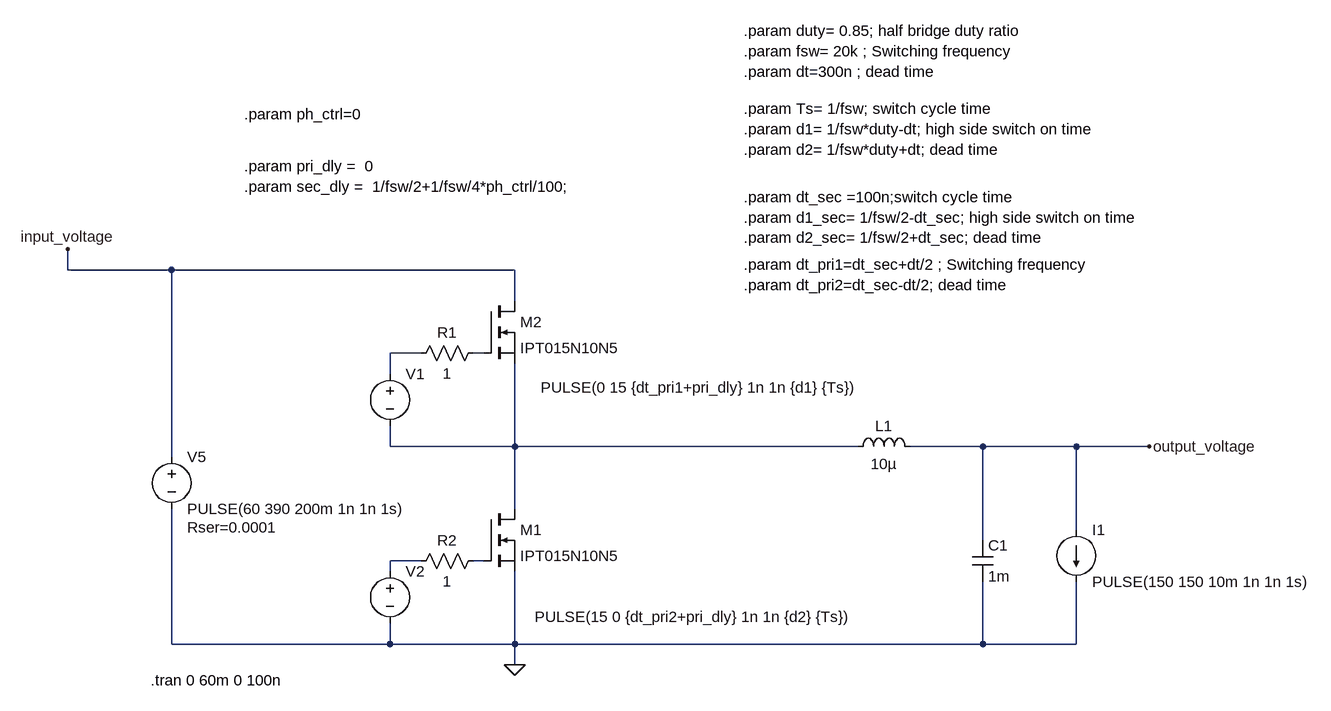
[diagram p0: schematic synch_buck_highcurrent.asc]
synch_buck_highcurrent.asc, the LTspice schematic file:
Version 4
SHEET 1 3064 1092
WIRE -880 -208 -880 -240
WIRE -720 -208 -880 -208
WIRE -192 -208 -720 -208
WIRE -192 -160 -192 -208
WIRE -336 -80 -384 -80
WIRE -240 -80 -256 -80
WIRE -384 -48 -384 -80
WIRE -384 64 -384 32
WIRE -192 64 -192 -64
WIRE -192 64 -384 64
WIRE 336 64 -192 64
WIRE 528 64 416 64
WIRE 672 64 528 64
WIRE 784 64 672 64
WIRE -720 80 -720 -208
WIRE -192 160 -192 64
WIRE 672 192 672 64
WIRE 528 208 528 64
WIRE -336 240 -384 240
WIRE -240 240 -256 240
WIRE -384 256 -384 240
WIRE -720 368 -720 160
WIRE -384 368 -384 336
WIRE -384 368 -720 368
WIRE -192 368 -192 256
WIRE -192 368 -384 368
WIRE 528 368 528 272
WIRE 528 368 -192 368
WIRE 672 368 672 272
WIRE 672 368 528 368
WIRE -192 400 -192 368
FLAG -192 400 0
FLAG -880 -240 input_voltage
FLAG 784 64 output_voltage
SYMBOL nmos -240 160 R0
SYMATTR InstName M1
SYMATTR Value IPT015N10N5
SYMBOL nmos -240 -160 R0
SYMATTR InstName M2
SYMATTR Value IPT015N10N5
SYMBOL voltage -384 -64 R0
WINDOW 123 0 0 Left 2
WINDOW 39 0 0 Left 2
WINDOW 3 232 37 Left 2
SYMATTR Value PULSE(0 15 {dt_pri1+pri_dly} 1n 1n {d1} {Ts})
SYMATTR InstName V1
SYMBOL voltage -384 240 R0
WINDOW 123 0 0 Left 2
WINDOW 39 0 0 Left 2
WINDOW 3 223 86 Left 2
SYMATTR Value PULSE(15 0 {dt_pri2+pri_dly} 1n 1n {d2} {Ts})
SYMATTR InstName V2
SYMBOL res -240 -96 R90
WINDOW 0 0 56 VBottom 2
WINDOW 3 32 56 VTop 2
SYMATTR InstName R1
SYMATTR Value 1
SYMBOL res -240 224 R90
WINDOW 0 0 56 VBottom 2
WINDOW 3 32 56 VTop 2
SYMATTR InstName R2
SYMATTR Value 1
SYMBOL voltage -720 64 R0
WINDOW 123 0 0 Left 2
WINDOW 39 24 124 Left 2
SYMATTR SpiceLine Rser=0.0001
SYMATTR InstName V5
SYMATTR Value PULSE(60 390 200m 1n 1n 1s)
SYMBOL ind 320 80 R270
WINDOW 0 32 56 VTop 2
WINDOW 3 5 56 VBottom 2
SYMATTR InstName L1
SYMATTR Value 10µ
SYMATTR SpiceLine Rser=1m
SYMBOL cap 512 208 R0
SYMATTR InstName C1
SYMATTR Value 1m
SYMBOL current 672 192 R0
WINDOW 123 0 0 Left 0
WINDOW 39 0 0 Left 0
SYMATTR InstName I1
SYMATTR Value PULSE(150 150 10m 1n 1n 1s)
TEXT -752 424 Left 2 !.tran 0 60m 0 100n
TEXT 160 -576 Left 2 !.param duty= 0.85; half bridge duty ratio\n.param fsw= 20k ; Switching frequency\n.param dt=300n ; dead time
TEXT 160 -456 Left 2 !.param Ts= 1/fsw; switch cycle time\n.param d1= 1/fsw*duty-dt; high side switch on time\n.param d2= 1/fsw*duty+dt; dead time
TEXT 160 -320 Left 2 !.param dt_sec =100n;switch cycle time\n.param d1_sec= 1/fsw/2-dt_sec; high side switch on time\n.param d2_sec= 1/fsw/2+dt_sec; dead time
TEXT 160 -216 Left 2 !.param dt_pri1=dt_sec+dt/2 ; Switching frequency\n.param dt_pri2=dt_sec-dt/2; dead time
TEXT -608 -368 Left 2 !.param pri_dly =  0
TEXT -608 -336 Left 2 !.param sec_dly =  1/fsw/2+1/fsw/4*ph_ctrl/100;
TEXT -608 -448 Left 2 !.param ph_ctrl=0

The netlist it stands for:
* synch_buck_highcurrent.asc
M1 N003 N005 0 0 IPT015N10N5
M2 input_voltage N002 N003 N003 IPT015N10N5
V1 N001 N003 PULSE(0 15 {dt_pri1+pri_dly} 1n 1n {d1} {Ts})
V2 N004 0 PULSE(15 0 {dt_pri2+pri_dly} 1n 1n {d2} {Ts})
R1 N002 N001 1
R2 N005 N004 1
V5 input_voltage 0 PULSE(60 390 200m 1n 1n 1s) Rser=0.0001
L1 N003 output_voltage 10µ Rser=1m
C1 output_voltage 0 1m
I1 output_voltage 0 PULSE(150 150 10m 1n 1n 1s)
.model NMOS NMOS
.model PMOS PMOS
.lib standard.mos
.tran 0 60m 0 100n
.param duty= 0.85; half bridge duty ratio
.param fsw= 20k ; Switching frequency
.param dt=300n ; dead time
.param Ts= 1/fsw; switch cycle time
.param d1= 1/fsw*duty-dt; high side switch on time
.param d2= 1/fsw*duty+dt; dead time
.param dt_sec =100n;switch cycle time
.param d1_sec= 1/fsw/2-dt_sec; high side switch on time
.param d2_sec= 1/fsw/2+dt_sec; dead time
.param dt_pri1=dt_sec+dt/2 ; Switching frequency
.param dt_pri2=dt_sec-dt/2; dead time
.param pri_dly =  0
.param sec_dly =  1/fsw/2+1/fsw/4*ph_ctrl/100;
.param ph_ctrl=0
.backanno
.end